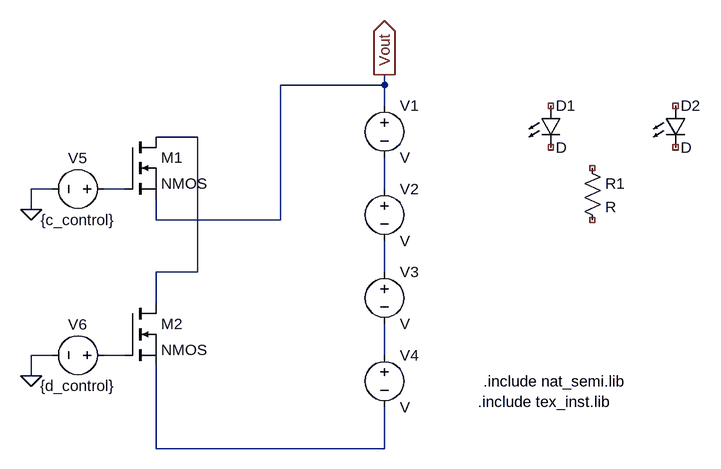
[diagram p0: schematic Draft.asc]
Draft.asc, the LTspice schematic file:
Version 4.1
SHEET 1 1468 680
WIRE 960 -64 960 -80
WIRE 960 -64 800 -64
WIRE 960 -32 960 -64
WIRE 672 16 608 16
WIRE 448 96 416 96
WIRE 560 96 528 96
WIRE 960 96 960 48
WIRE 416 128 416 96
WIRE 608 144 608 112
WIRE 800 144 800 -64
WIRE 800 144 608 144
WIRE 672 224 672 16
WIRE 672 224 608 224
WIRE 960 224 960 176
WIRE 608 272 608 224
WIRE 448 352 416 352
WIRE 560 352 528 352
WIRE 960 352 960 304
WIRE 416 384 416 352
WIRE 608 496 608 368
WIRE 960 496 960 432
WIRE 960 496 608 496
FLAG 960 -80 Vout
IOPIN 960 -80 Out
FLAG 416 128 0
FLAG 416 384 0
SYMBOL voltage 960 -48 R0
SYMATTR InstName V1
SYMBOL voltage 960 80 R0
SYMATTR InstName V2
SYMBOL voltage 960 208 R0
SYMATTR InstName V3
SYMBOL voltage 960 336 R0
SYMATTR InstName V4
SYMBOL nmos 560 16 R0
SYMATTR InstName M1
SYMBOL nmos 560 272 R0
SYMATTR InstName M2
SYMBOL voltage 544 96 R90
WINDOW 0 -32 56 VBottom 2
WINDOW 3 32 56 VTop 2
SYMATTR InstName V5
SYMATTR Value {c_control}
SYMBOL voltage 544 352 R90
WINDOW 0 -32 56 VBottom 2
WINDOW 3 32 56 VTop 2
SYMATTR InstName V6
SYMATTR Value {d_control}
SYMBOL res 1264 48 R0
SYMATTR InstName R1
SYMBOL LED 1200 -32 R0
SYMATTR InstName D1
SYMBOL LED 1392 -32 R0
SYMATTR InstName D2
TEXT 1112 392 Left 2 !.include nat_semi.lib
TEXT 1104 424 Left 2 !.include tex_inst.lib

The netlist it stands for:
* Draft.asc
V1 Vout N003 V
V2 N003 N004 V
V3 N004 N006 V
V4 N006 N007 V
M1 N001 N002 Vout Vout NMOS
M2 N001 N005 N007 N007 NMOS
V5 N002 0 {c_control}
V6 N005 0 {d_control}
R1 NC_01 NC_02 R
D1 NC_03 NC_04 D
D2 NC_05 NC_06 D
.model D D
.lib standard.dio
.model NMOS NMOS
.model PMOS PMOS
.lib standard.mos
.include nat_semi.lib
.include tex_inst.lib
.backanno
.end